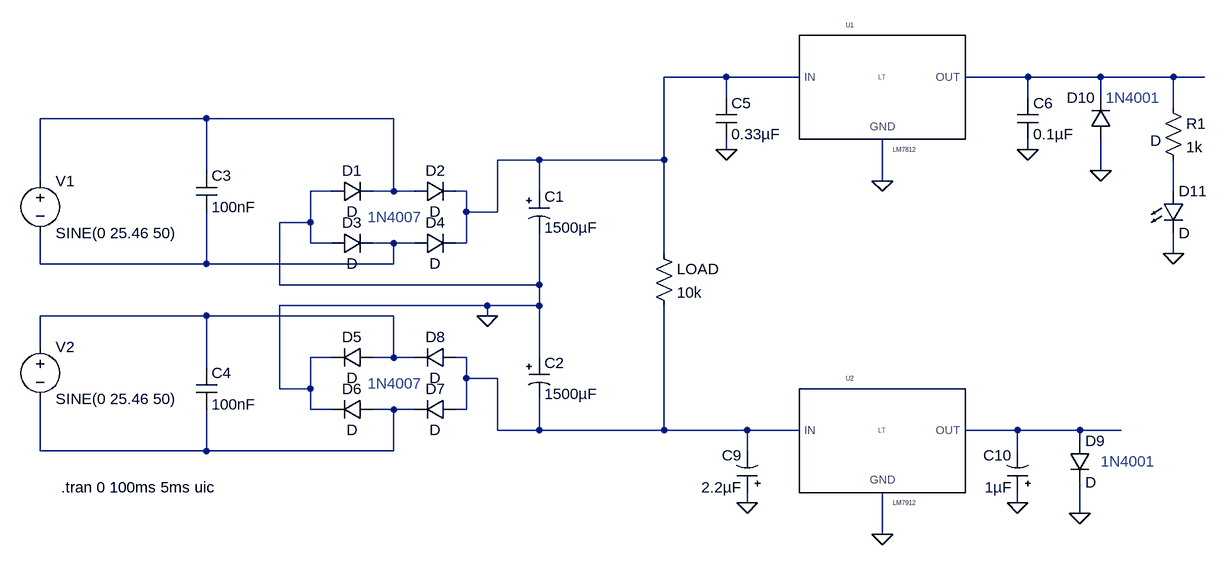
[diagram p0: schematic power_supply.asc]
power_supply.asc, the LTspice schematic file:
Version 4
SHEET 1 1756 680
WIRE 1008 -80 912 -80
WIRE 1120 -80 1008 -80
WIRE 1472 -80 1376 -80
WIRE 1584 -80 1472 -80
WIRE 1696 -80 1584 -80
WIRE 1744 -80 1696 -80
WIRE 1008 -48 1008 -80
WIRE 1472 -48 1472 -80
WIRE 1584 -48 1584 -80
WIRE 1696 -32 1696 -80
WIRE 208 -16 -48 -16
WIRE 496 -16 208 -16
WIRE 1008 32 1008 16
WIRE 1472 32 1472 16
WIRE 720 48 656 48
WIRE 912 48 912 -80
WIRE 912 48 720 48
WIRE 208 64 208 -16
WIRE 1584 64 1584 16
WIRE -48 80 -48 -16
WIRE 1248 80 1248 16
WIRE 400 96 368 96
WIRE 496 96 496 -16
WIRE 496 96 464 96
WIRE 528 96 496 96
WIRE 608 96 592 96
WIRE 720 96 720 48
WIRE 1696 96 1696 48
WIRE 608 128 608 96
WIRE 656 128 656 48
WIRE 656 128 608 128
WIRE 368 144 368 96
WIRE 368 144 320 144
WIRE 368 176 368 144
WIRE 400 176 368 176
WIRE 496 176 464 176
WIRE 528 176 496 176
WIRE 608 176 608 128
WIRE 608 176 592 176
WIRE 912 192 912 48
WIRE 1696 192 1696 160
WIRE -48 208 -48 160
WIRE 208 208 208 128
WIRE 208 208 -48 208
WIRE 496 208 496 176
WIRE 496 208 208 208
WIRE 320 240 320 144
WIRE 720 240 720 160
WIRE 720 240 320 240
WIRE 640 272 320 272
WIRE 720 272 720 240
WIRE 720 272 640 272
WIRE 208 288 -48 288
WIRE 496 288 208 288
WIRE 640 288 640 272
WIRE -48 336 -48 288
WIRE 400 352 368 352
WIRE 496 352 496 288
WIRE 496 352 464 352
WIRE 528 352 496 352
WIRE 608 352 592 352
WIRE 720 352 720 272
WIRE 208 368 208 288
WIRE 608 384 608 352
WIRE 656 384 608 384
WIRE 320 400 320 272
WIRE 368 400 368 352
WIRE 368 400 320 400
WIRE 368 432 368 400
WIRE 400 432 368 432
WIRE 496 432 464 432
WIRE 528 432 496 432
WIRE 608 432 608 384
WIRE 608 432 592 432
WIRE 656 464 656 384
WIRE 720 464 720 416
WIRE 720 464 656 464
WIRE 912 464 912 272
WIRE 912 464 720 464
WIRE 1040 464 912 464
WIRE 1120 464 1040 464
WIRE 1456 464 1376 464
WIRE 1552 464 1456 464
WIRE 1616 464 1552 464
WIRE 1552 480 1552 464
WIRE -48 496 -48 416
WIRE 208 496 208 432
WIRE 208 496 -48 496
WIRE 496 496 496 432
WIRE 496 496 208 496
WIRE 1040 496 1040 464
WIRE 1456 496 1456 464
WIRE 1040 576 1040 560
WIRE 1456 576 1456 560
WIRE 1552 592 1552 544
WIRE 1248 624 1248 560
FLAG 640 288 0
FLAG 1008 32 0
FLAG 1472 32 0
FLAG 1248 80 0
FLAG 1248 624 0
FLAG 1456 576 0
FLAG 1040 576 0
FLAG 1552 592 0
FLAG 1584 64 0
FLAG 1696 192 0
SYMBOL diode 400 112 R270
WINDOW 0 32 32 VTop 2
WINDOW 3 0 32 VBottom 2
SYMATTR InstName D1
SYMBOL res 896 176 R0
SYMATTR InstName LOAD
SYMATTR Value 10k
SYMBOL diode 400 192 R270
WINDOW 0 32 32 VTop 2
WINDOW 3 0 32 VBottom 2
SYMATTR InstName D3
SYMBOL diode 528 192 R270
WINDOW 0 32 32 VTop 2
WINDOW 3 0 32 VBottom 2
SYMATTR InstName D4
SYMBOL diode 528 112 R270
WINDOW 0 32 32 VTop 2
WINDOW 3 0 32 VBottom 2
SYMATTR InstName D2
SYMBOL voltage -48 64 R0
WINDOW 123 0 0 Left 2
WINDOW 39 0 0 Left 2
SYMATTR InstName V1
SYMATTR Value SINE(0 25.46 50)
SYMBOL voltage -48 320 R0
WINDOW 123 0 0 Left 2
WINDOW 39 0 0 Left 2
SYMATTR InstName V2
SYMATTR Value SINE(0 25.46 50)
SYMBOL diode 464 368 M270
WINDOW 0 32 32 VTop 2
WINDOW 3 0 32 VBottom 2
SYMATTR InstName D5
SYMBOL diode 464 448 M270
WINDOW 0 32 32 VTop 2
WINDOW 3 0 32 VBottom 2
SYMATTR InstName D6
SYMBOL diode 592 448 M270
WINDOW 0 32 32 VTop 2
WINDOW 3 0 32 VBottom 2
SYMATTR InstName D7
SYMBOL diode 592 368 M270
WINDOW 0 32 32 VTop 2
WINDOW 3 0 32 VBottom 2
SYMATTR InstName D8
SYMBOL cap 192 64 R0
SYMATTR InstName C3
SYMATTR Value 100nF
SYMBOL cap 192 368 R0
SYMATTR InstName C4
SYMATTR Value 100nF
SYMBOL 7812 1248 -80 R0
SYMATTR InstName U1
SYMBOL 7912 1248 464 R0
SYMATTR InstName U2
SYMBOL cap 992 -48 R0
SYMATTR InstName C5
SYMATTR Value 0.33µF
SYMBOL cap 1456 -48 R0
SYMATTR InstName C6
SYMATTR Value 0.1µF
SYMBOL polcap 1056 560 R180
WINDOW 0 24 57 Left 2
WINDOW 3 24 8 Left 2
SYMATTR InstName C9
SYMATTR Value 2.2µF
SYMBOL polcap 1472 560 R180
WINDOW 0 24 57 Left 2
WINDOW 3 24 8 Left 2
SYMATTR InstName C10
SYMATTR Value 1µF
SYMBOL diode 1536 480 R0
SYMATTR InstName D9
SYMBOL diode 1600 16 R180
WINDOW 0 24 64 Left 2
WINDOW 3 -78 -2 Left 2
SYMATTR InstName D10
SYMBOL LED 1680 96 R0
SYMATTR InstName D11
SYMBOL res 1680 -48 R0
SYMATTR InstName R1
SYMATTR Value 1k
SYMBOL polcap 704 96 R0
SYMATTR InstName C1
SYMATTR Value 1500µF
SYMBOL polcap 704 352 R0
SYMATTR InstName C2
SYMATTR Value 1500µF
TEXT -16 552 Left 2 !.tran 0 100ms 5ms uic
TEXT 456 136 Left 2 ;1N4007
TEXT 1592 -48 Left 2 ;1N4001
TEXT 1584 512 Left 2 ;1N4001
TEXT 456 392 Left 2 ;1N4007

The netlist it stands for:
* power_supply.asc
D1 0 N003 D
R§LOAD N001 N007 10k
D3 0 N005 D
D4 N005 N001 D
D2 N003 N001 D
V1 N003 N005 SINE(0 25.46 50)
V2 N006 N008 SINE(0 25.46 50)
D5 N006 0 D
D6 N008 0 D
D7 N007 N008 D
D8 N007 N006 D
C3 N003 N005 100nF
C4 N006 N008 100nF
XU1 N001 0 N002 LM7812  ; pins IN GND OUT
XU2 N007 0 N009 LM7912  ; pins IN GND OUT
C5 N001 0 0.33µF
C6 N002 0 0.1µF
C9 0 N007 2.2µF
C10 0 N009 1µF
D9 N009 0 D
D10 0 N002 D
D11 N004 0 D
R1 N002 N004 1k
C1 N001 0 1500µF
C2 0 N007 1500µF
.model D D
.lib standard.dio
.tran 0 100ms 5ms uic
* 1N4007
* 1N4001
* 1N4001
* 1N4007
.lib lm7805_7812_7815.lib
.lib lm7905_7912_7915.lib
.backanno
.end